# EAGLE schematic HP03S_SHT1x (EAGLE 4.16)
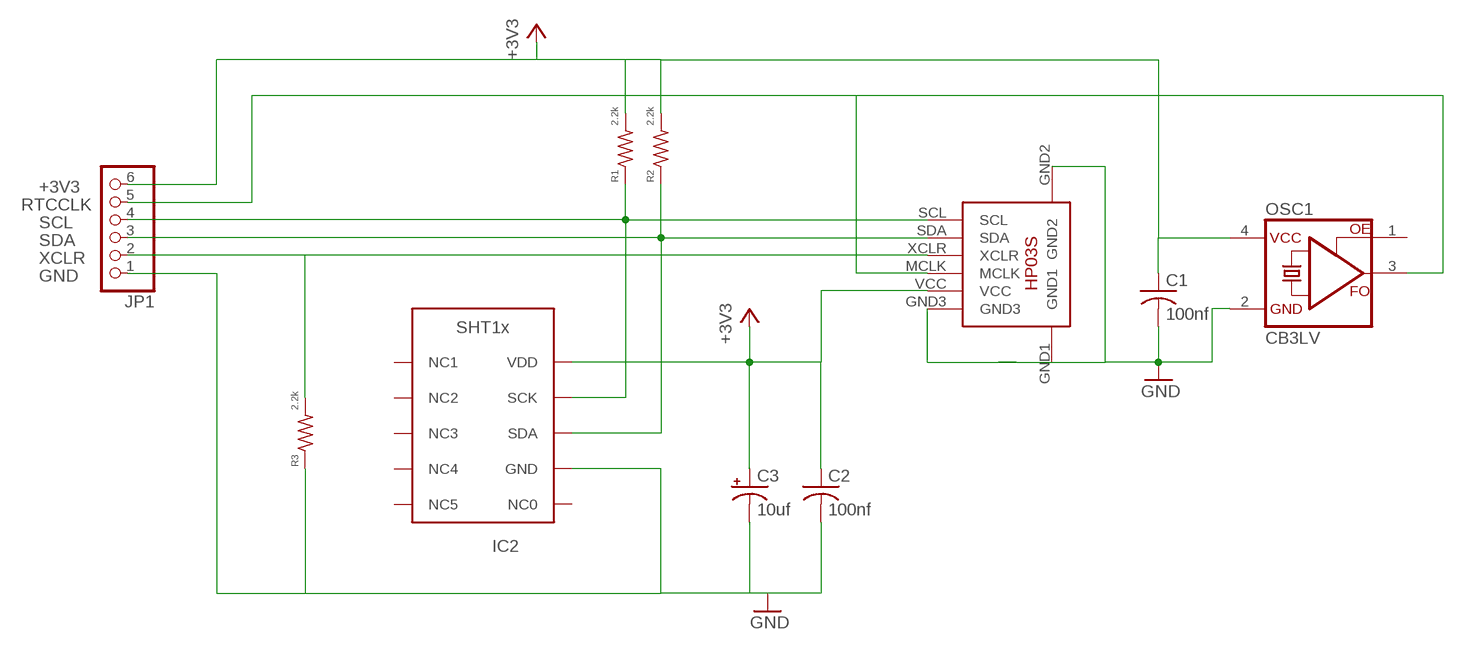
[diagram p0: schematic, sheet 1]

## Parts
C1  100nf  C-USC0805  [C0805]
C2  100nf  C-USC0805K  [C0805K]
C3  10uf  CPOL-USSMCP  [SMC_P]
IC1  HP03S  [HP03S]
IC2  SHT1X  [SHT1X]
JP1  PINHD-1X6  [1X06]
OSC1  CB3LV  [SMD7.5X5MM]
R1  2.2k  R-US_R0603  [R0603]
R2  2.2k  R-US_R0603  [R0603]
R3  2.2k  R-US_R0603  [R0603]

## Nets
+3V3: C1.1 C2.1 C3.+ IC1.VCC IC2.P$5(VDD) JP1.6 OSC1.4(VCC) R1.2 R2.2
GND: C1.2 C2.2 C3.- IC1.GND1 IC1.GND2 IC1.GND3 IC2.P$2(GND) JP1.1 OSC1.2(GND) R3.1
RTCCLK: IC1.MCLK JP1.5 OSC1.3(FO)
SCL: IC1.SCL IC2.P$4(SCK) JP1.4 R1.1
SDA: IC1.SDA IC2.P$3(SDA) JP1.3 R2.1
XCLR: IC1.XCLR JP1.2 R3.2
Unconnected: IC2.P$1(NC0) IC2.P$6(NC1) IC2.P$7(NC2) IC2.P$8(NC3) IC2.P$9(NC4) IC2.P$10(NC5) OSC1.1(OE)

## Library data of the parts
C1 C2 = rcl:C-US: CAPACITOR, American symbol
C3 = rcl:CPOL-US: POLARIZED CAPACITOR, American symbol
IC1 = ATMEL:HP03S
IC2 = Stofer:SHT1X: Sensiron Humidity sensor
JP1 = Headers:PINHD-1X6: PIN HEADER
OSC1 = crystal:CB3LV
R1-R3 = rcl:R-US_: RESISTOR, American symbol